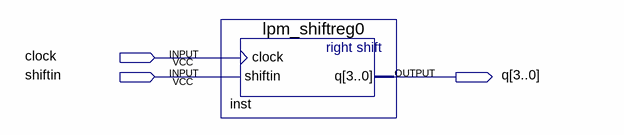
[diagram p0: schematic sheet]
// Quartus schematic Block2.bdf as structural Verilog: 1 symbols, 3 pins
module Block2 (
  input  clock,
  input  shiftin,
  output [3:0] q
);

  lpm_shiftreg0 inst (.clock(clock), .shiftin(shiftin), .q(q));
endmodule
